# EAGLE design damp_v0001B (EAGLE 6.4)

## Sheet 1 of 2: DAC
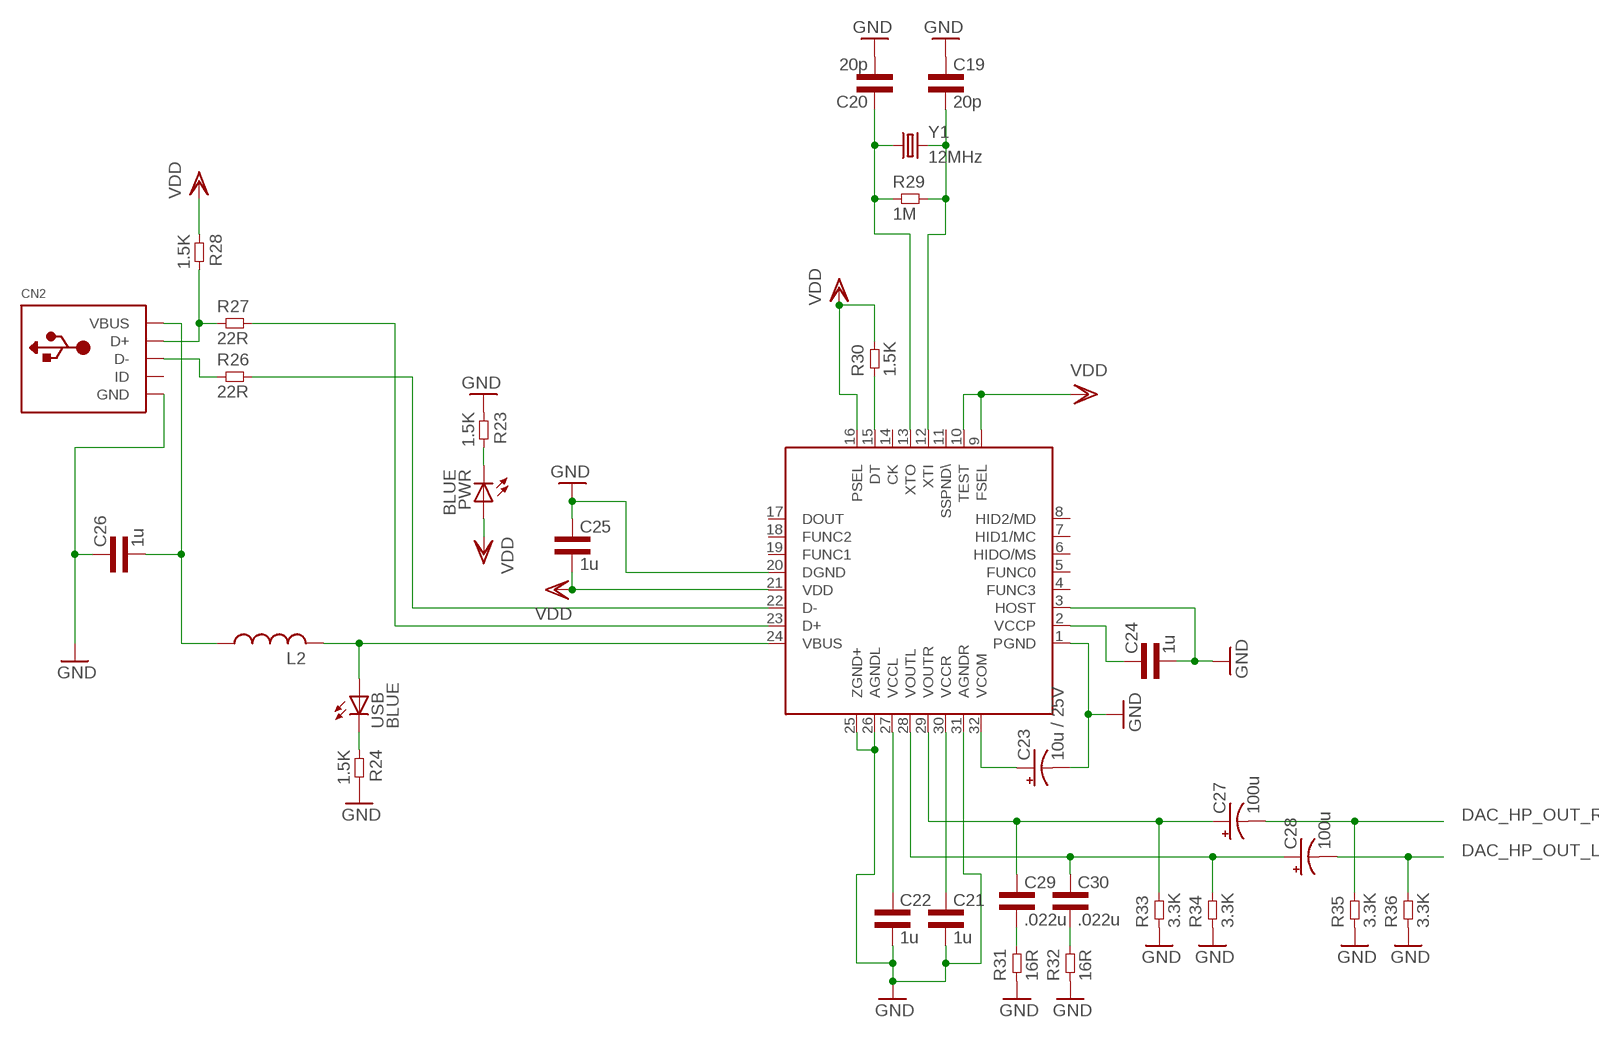
[diagram p0: schematic, sheet 1]

### Parts
C19  20p  CAP0603L3  [0603L3]
C20  20p  CAP0603L3  [0603L3]
C21  1u  CAP0603L3  [0603L3]
C22  1u  CAP0603L3  [0603L3]
C23  10u / 25V  CPOL-USE1.8-4  [E1,8-4]
C24  1u  CAP0603L3  [0603L3]
C25  1u  CAP0603L3  [0603L3]
C26  1u  CAP0603L3  [0603L3]
C27  100u  CPOL-USE2-5  [E2-5]
C28  100u  CPOL-USE2-5  [E2-5]
C29  .022u  CAP0603L3  [0603L3]
C30  .022u  CAP0603L3  [0603L3]
CN2  USBMINIB  [USB-MINIB]
L2  RCL_L-USL3225M  [RCL_L3225M]
PWR  BLUE  LED-BLUE0603  [LED-0603]
R23  1.5K  RES0603L3  [0603L3]
R24  1.5K  RES0603L3  [0603L3]
R26  22R  RES0603L3  [0603L3]
R27  22R  RES0603L3  [0603L3]
R28  1.5K  RES0603L3  [0603L3]
R29  1M  RES0603L3  [0603L3]
R30  1.5K  RES0603L3  [0603L3]
R31  16R  RES0603L3  [0603L3]
R32  16R  RES0603L3  [0603L3]
R33  3.3K  RES0603L3  [0603L3]
R34  3.3K  RES0603L3  [0603L3]
R35  3.3K  RES0603L3  [0603L3]
R36  3.3K  RES0603L3  [0603L3]
U$1  PCM2707_V1_PCM2704C_PCM2707  [PCM2707_V1_PCM2704C_PCM2707]
USB  BLUE  LED-BLUE0603  [LED-0603]
Y1  12MHz  CRYSTALHC49US  [HC49US]

### Nets
DAC_HP_OUT_L: C28.- R36.P$2 ; also sheet 2
DAC_HP_OUT_R: C27.- R35.P$2 ; also sheet 2
GND: C19.P$1 C20.P$2 C21.P$2 C22.P$2 C23.- C24.P$2 C25.P$1 C26.P$1 CN2.GND R23.P$1 R24.P$2 R31.P$1 R32.P$1 R33.P$1 R34.P$1 R35.P$1 R36.P$1 U$1.1(PGND) U$1.3(HOST) U$1.20(DGND) U$1.25(ZGND+) U$1.26(AGNDL) U$1.31(AGNDR) ; also sheet 2
N$2: PWR.C R23.P$2
N$6: R24.P$1 USB.C
N$18: CN2.D+ R27.P$1 R28.P$2
N$21: CN2.D- R26.P$1
N$37: R27.P$2 U$1.23(D+)
N$42: R26.P$2 U$1.22(D-)
N$43: C20.P$1 R29.P$1 U$1.13(XTO) Y1.1
N$44: C19.P$2 R29.P$2 U$1.12(XTI) Y1.2
N$45: C22.P$1 U$1.27(VCCL)
N$50: C21.P$1 U$1.30(VCCR)
N$51: C23.+ U$1.32(VCOM)
N$52: C29.P$2 R31.P$2
N$53: C24.P$1 U$1.2(VCCP)
N$54: C27.+ C29.P$1 R33.P$2 U$1.29(VOUTR)
N$55: L2.2 U$1.24(VBUS) USB.A
N$56: C26.P$2 CN2.VBUS L2.1
N$57: C28.+ C30.P$1 R34.P$2 U$1.28(VOUTL)
N$58: R30.P$1 U$1.15(DT)
N$59: C30.P$2 R32.P$2
VDD: C25.P$2 PWR.A R28.P$1 R30.P$2 U$1.9(FSEL) U$1.10(TEST) U$1.16(PSEL) U$1.21(VDD)
Unconnected: CN2.ID U$1.4(FUNC3) U$1.5(FUNC0) U$1.6(HIDO/MS) U$1.7(HID1/MC) U$1.8(HID2/MD) U$1.11(SSPND\) U$1.14(CK) U$1.17(DOUT) U$1.18(FUNC2) U$1.19(FUNC1)

## Sheet 2 of 2: Amp
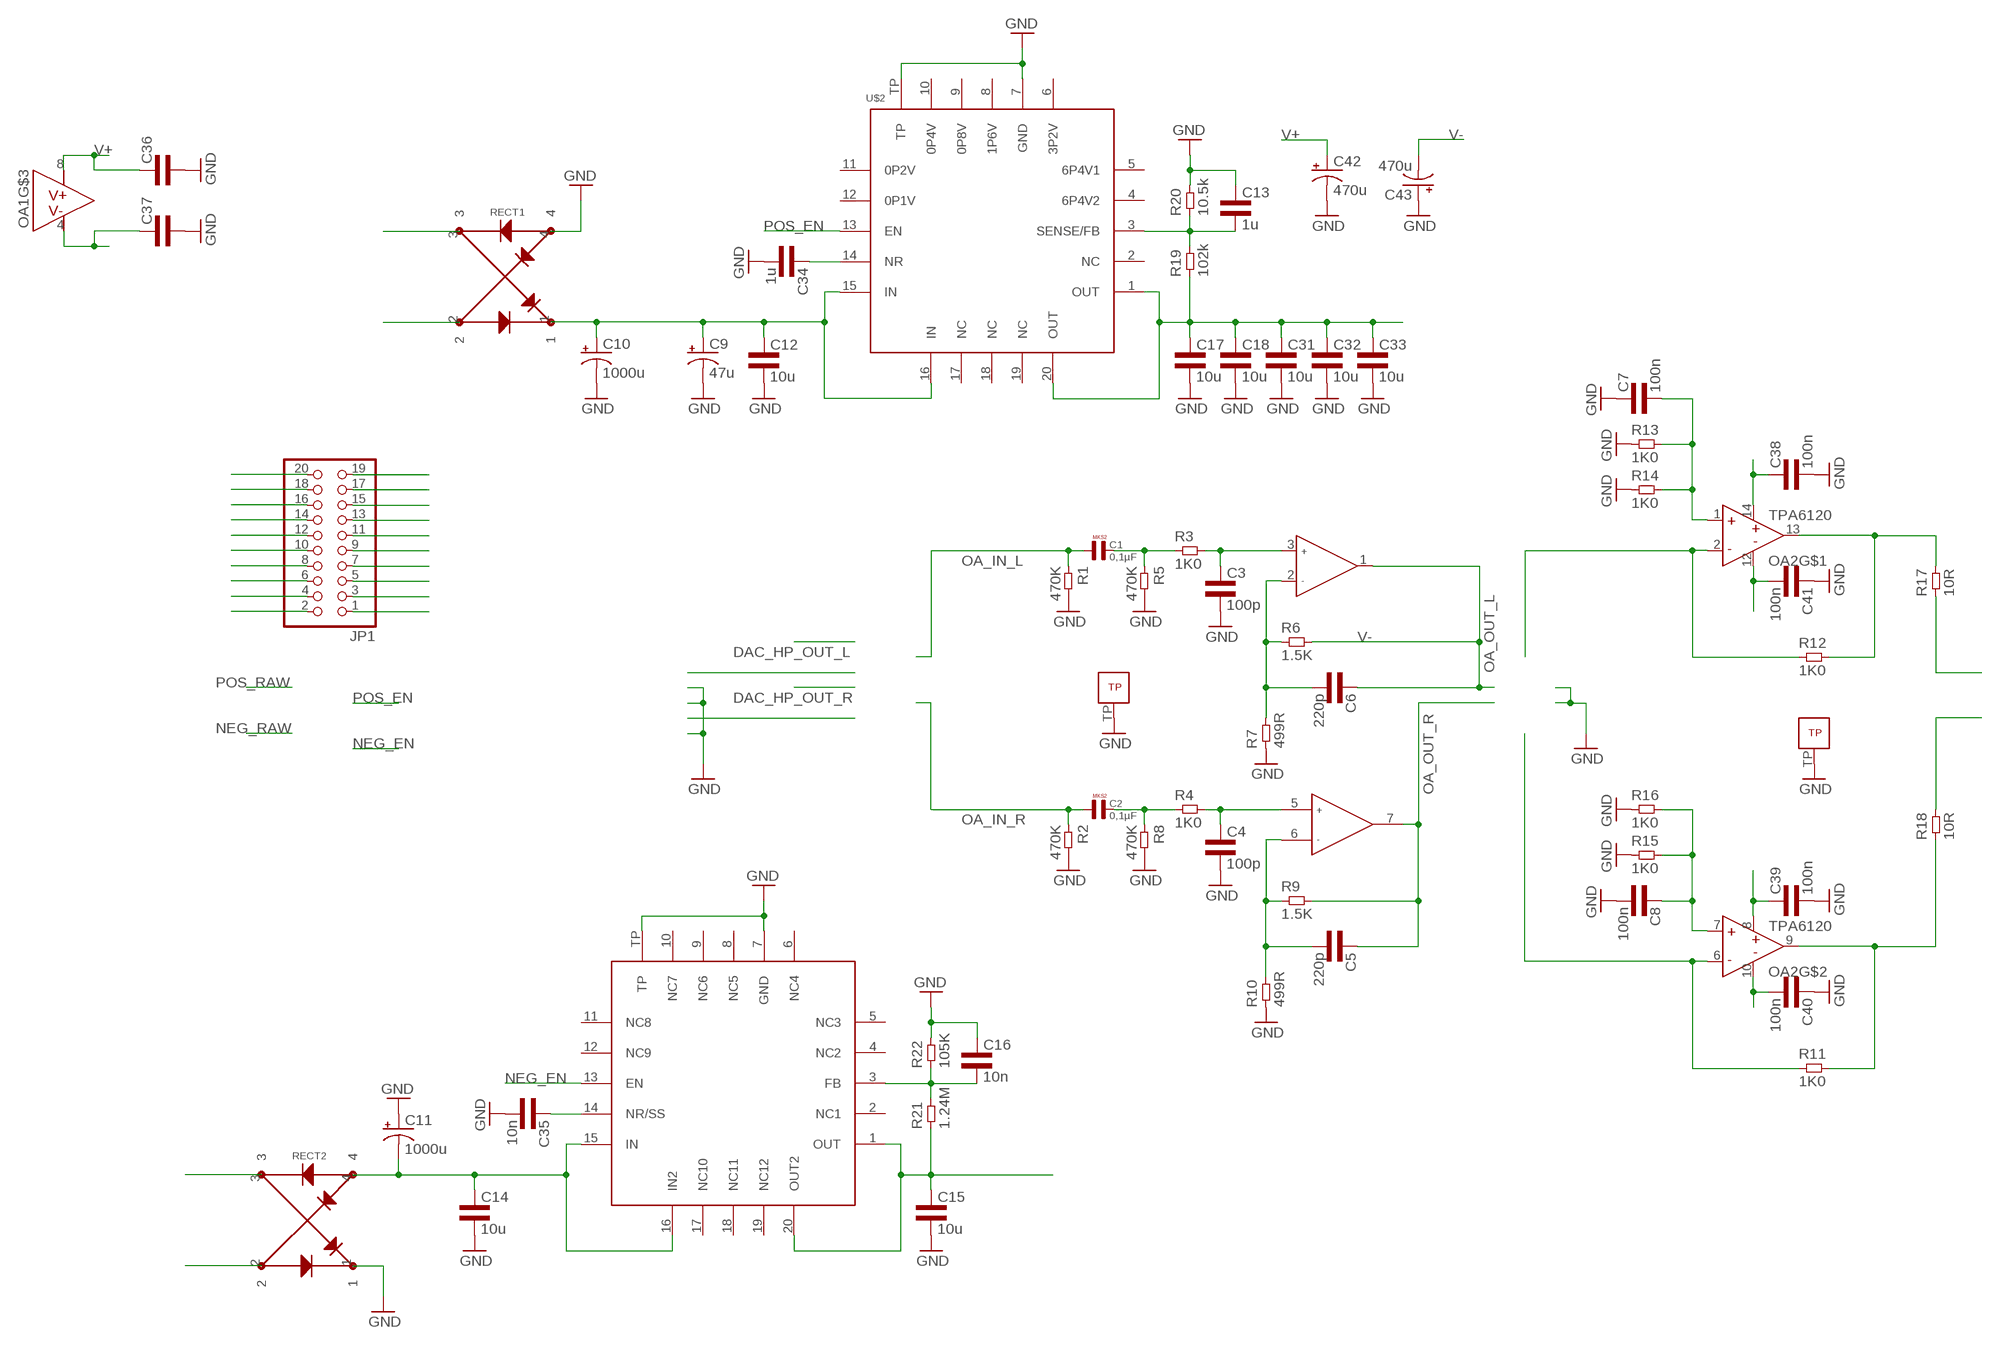
[diagram p1: schematic, sheet 2]

### Parts
C1  0,1µF  [R5B2K5]
C2  0,1µF  [R5B2K5]
C3  100p  CAP0603L3  [0603L3]
C4  100p  CAP0603L3  [0603L3]
C5  220p  CAP0603L3  [0603L3]
C6  220p  CAP0603L3  [0603L3]
C7  100n  CAP0603L3  [0603L3]
C8  100n  CAP0603L3  [0603L3]
C9  47u  CPOL-USCT7343  [CT7343]
C10  1000u  CPOL-USE7.5-16  [E7,5-16]
C11  1000u  CPOL-USE7.5-16  [E7,5-16]
C12  10u  CAP0805L3  [0805L3]
C13  1u  CAP0603L3  [0603L3]
C14  10u  CAP0805L3  [0805L3]
C15  10u  CAP0805L3  [0805L3]
C16  10n  CAP0603L3  [0603L3]
C17  10u  CAP0805L3  [0805L3]
C18  10u  CAP0805L3  [0805L3]
C31  10u  CAP0805L3  [0805L3]
C32  10u  CAP0805L3  [0805L3]
C33  10u  CAP0805L3  [0805L3]
C34  1u  CAP0603L3  [0603L3]
C35  10n  CAP0603L3  [0603L3]
C36  CAP0603L3  [0603L3]
C37  CAP0603L3  [0603L3]
C38  100n  CAP0603L3  [0603L3]
C39  100n  CAP0603L3  [0603L3]
C40  100n  CAP0603L3  [0603L3]
C41  100n  CAP0603L3  [0603L3]
C42  470u  CPOL-USE5-10.5  [E5-10,5]
C43  470u  CPOL-USE5-10.5  [E5-10,5]
JP1  PINHD-2X10  [2X10]
OA1  OPA1612  [S-PWSON-N8]
OA2  TPA6120QFN  [S-PVQFN-N14]
R1  470K  RES0603L3  [0603L3]
R2  470K  RES0603L3  [0603L3]
R3  1K0  RES0603L3  [0603L3]
R4  1K0  RES0603L3  [0603L3]
R5  470K  RES0603L3  [0603L3]
R6  1.5K  RES0603L3  [0603L3]
R7  499R  RES0603L3  [0603L3]
R8  470K  RES0603L3  [0603L3]
R9  1.5K  RES0603L3  [0603L3]
R10  499R  RES0603L3  [0603L3]
R11  1K0  RES0603L3  [0603L3]
R12  1K0  RES0603L3  [0603L3]
R13  1K0  RES0603L3  [0603L3]
R14  1K0  RES0603L3  [0603L3]
R15  1K0  RES0603L3  [0603L3]
R16  1K0  RES0603L3  [0603L3]
R17  10R  RES1206L3  [1206L3]
R18  10R  RES1206L3  [1206L3]
R19  102k  RES0603L3  [0603L3]
R20  10.5k  RES0603L3  [0603L3]
R21  1.24M  RES0603L3  [0603L3]
R22  105K  RES0603L3  [0603L3]
RECT1  RECTIFIER_Z4GP206  [RECTIFIER_ABS-4]
RECT2  RECTIFIER_Z4GP206  [RECTIFIER_ABS-4]
U$2  POWER-SUPPLY_POS_V1_TI_LDO_TPS7A4700  [POWER-SUPPLY_POS_V1_TI_LDO_VQFN-20]
U$3  POWER-SUPPLY_POS_V1_TI_LDO_TPS7A3301RGWT  [POWER-SUPPLY_POS_V1_TI_LDO_VQFN-20]

### Nets
AC1: RECT1.3
AC2: RECT1.2
AC3: RECT2.3
AC4: RECT2.2
GND: C3.P$2 C4.P$2 C7.P$1 C8.P$2 C9.- C10.- C11.+ C12.2 C13.P$1 C14.2 C15.2 C16.P$1 C17.2 C18.2 C31.2 C32.2 C33.2 C34.P$2 C35.P$2 C36.P$2 C37.P$2 C38.P$2 C39.P$2 C40.P$1 C41.P$1 C42.- C43.+ OA1.TP OA2.TP R1.P$2 R2.P$2 R5.P$2 R7.P$1 R8.P$2 R10.P$1 R13.P$1 R14.P$1 R15.P$1 R16.P$1 R20.P$2 R22.P$2 RECT1.4 RECT2.1 U$2.7(GND) U$2.TP U$3.7(GND) U$3.TP ; also sheet 1
N$4: C34.P$1 U$2.14(NR)
N$5: OA2.9(OUT) R11.P$2 R18.1
N$7: C1.2 R3.P$1 R5.P$1
N$8: C3.P$1 OA1.3(INA+) R3.P$2
N$9: C6.P$2 OA1.2(INA-) R6.P$1 R7.P$2
N$10: OA2.2(IN-) R12.P$1
N$11: JP1.19
N$12: C2.2 R4.P$1 R8.P$1
N$13: C4.P$1 OA1.5(INB+) R4.P$2
N$14: JP1.17
N$15: C5.P$2 OA1.6(INB-) R9.P$1 R10.P$2
N$16: JP1.15
N$17: C7.P$2 OA2.1(IN+) R13.P$2 R14.P$2
N$19: C8.P$1 OA2.7(IN+) R15.P$2 R16.P$2
N$20: R17.1
N$22: R18.2
N$23: C13.P$2 R19.P$2 R20.P$1 U$2.3(SENSE/FB)
N$24: C16.P$2 R21.P$2 R22.P$1 U$3.3(FB)
N$25: C35.P$1 U$3.14(NR/SS)
N$26: OA2.6(IN-) R11.P$1
N$27: OA2.13(OUT) R12.P$2 R17.2
N$28: JP1.13
N$29: JP1.11
N$30: JP1.9
N$31: JP1.7
N$32: JP1.5
N$33: JP1.3
N$34: JP1.1
N$38: JP1.16
N$39: JP1.14
N$40: JP1.12
N$41: JP1.10
N$46: JP1.8
N$47: JP1.6
N$48: JP1.4
N$49: JP1.2
NEG_EN: U$3.13(EN)
NEG_RAW: C11.- C14.1 JP1.18 RECT2.4 U$3.15(IN) U$3.16(IN2)
OA_IN_L: C1.1 R1.P$1
OA_IN_R: C2.1 R2.P$1
OA_OUT_L: C6.P$1 OA1.1(OUTA) R6.P$2
OA_OUT_R: C5.P$1 OA1.7(OUTB) R9.P$2
POS_EN: U$2.13(EN)
POS_RAW: C9.+ C10.+ C12.1 JP1.20 RECT1.1 U$2.15(IN) U$2.16(IN)
V+: C17.1 C18.1 C31.1 C32.1 C33.1 C36.P$1 C39.P$1 C41.P$2 C42.+ OA2.8(V+) OA2.12(V-) R19.P$1 U$2.1(OUT) U$2.20(OUT)
V-: C15.1 C37.P$1 C38.P$1 C40.P$2 C43.- OA2.10(V-) OA2.14(V+) R21.P$1 U$3.1(OUT) U$3.20(OUT2)
Unconnected: U$2.2(NC) U$2.4(6P4V2) U$2.5(6P4V1) U$2.6(3P2V) U$2.8(1P6V) U$2.9(0P8V) U$2.10(0P4V) U$2.11(0P2V) U$2.12(0P1V) U$2.17(NC) U$2.18(NC) U$2.19(NC) U$3.2(NC1) U$3.4(NC2) U$3.5(NC3) U$3.6(NC4) U$3.8(NC5) U$3.9(NC6) U$3.10(NC7) U$3.11(NC8) U$3.12(NC9) U$3.17(NC10) U$3.18(NC11) U$3.19(NC12)

## Power pins joined to a net without a drawn wire
V+: OA1.8(V+)
V-: OA1.4(V-)

## Library data of the parts
C1 C2 = Capacitor-Wima-MKS2-63v:0,1µF
C3-C8 C12-C22 C24-C26 C29-C41 = common:CAP
C9-C11 C23 C27 C28 C42 C43 = rcl:CPOL-US: POLARIZED CAPACITOR, American symbol
CN2 = adafruit:USB: USB Connectors USBMINIB - Surface Mount Female Mini-B USB Connector 4UConnector: 06564 By microbuilder.eu Thru-hole RA Female Mini-B USB Connector 4UConnector: 18732 By ladyada.net
JP1 = pinhead:PINHD-2X10: PIN HEADER
L2 = pcm2707_v1:RCL_L-US: INDUCTOR, American symbol
OA1 = common:OPA1612
OA2 = common:TPA6120
PWR USB = SparkFun-LED:LED-BLUE: Blue LEDs for production use Various blue LEDs stocked by SparkFun production 0603 - DIO-08575 Rebel - DIO-09553 1206 - DIO-09911; PROD_ID: DIO-08575
R1-R24 R26-R36 = common:RES
RECT1 RECT2 = my_dac_amp:RECTIFIER_Z4GP206
U$1 = my_dac_amp:PCM2707_V1_PCM2704C_PCM2707: Upgraded version of the PCM2704. It allows connecting to a device with USB and transmitting that data to another DAC using I2S protocol. Also has other advanced features that allow control with SPI, external buttons, etc.
U$2 = my_dac_amp:POWER-SUPPLY_POS_V1_TI_LDO_TPS7A4700
U$3 = my_dac_amp:POWER-SUPPLY_POS_V1_TI_LDO_TPS7A3301RGWT: Ultra-Low Noise NEGATIVE Voltage Reglator
Y1 = SparkFun-FreqCtrl:CRYSTAL: Various standard crystals. Proven footprints. Spark Fun Electronics SKU : COM-00534

## Board
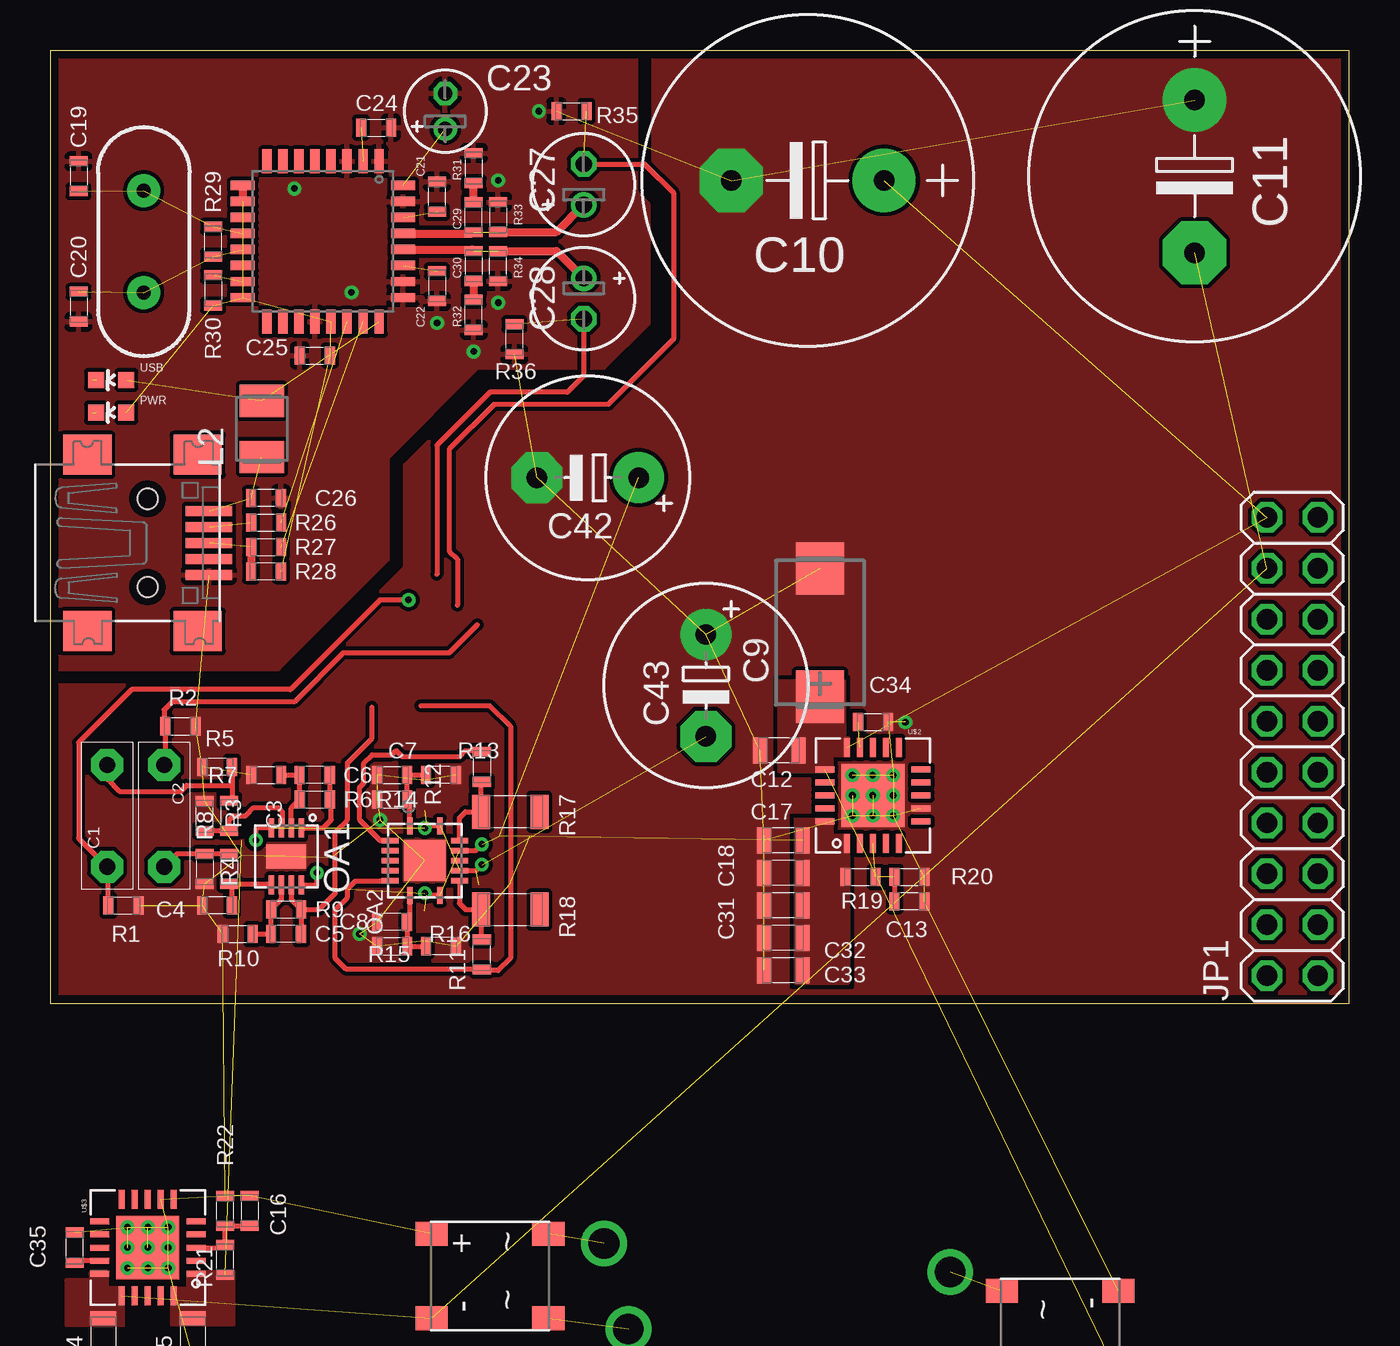
[diagram p2: board, top side]
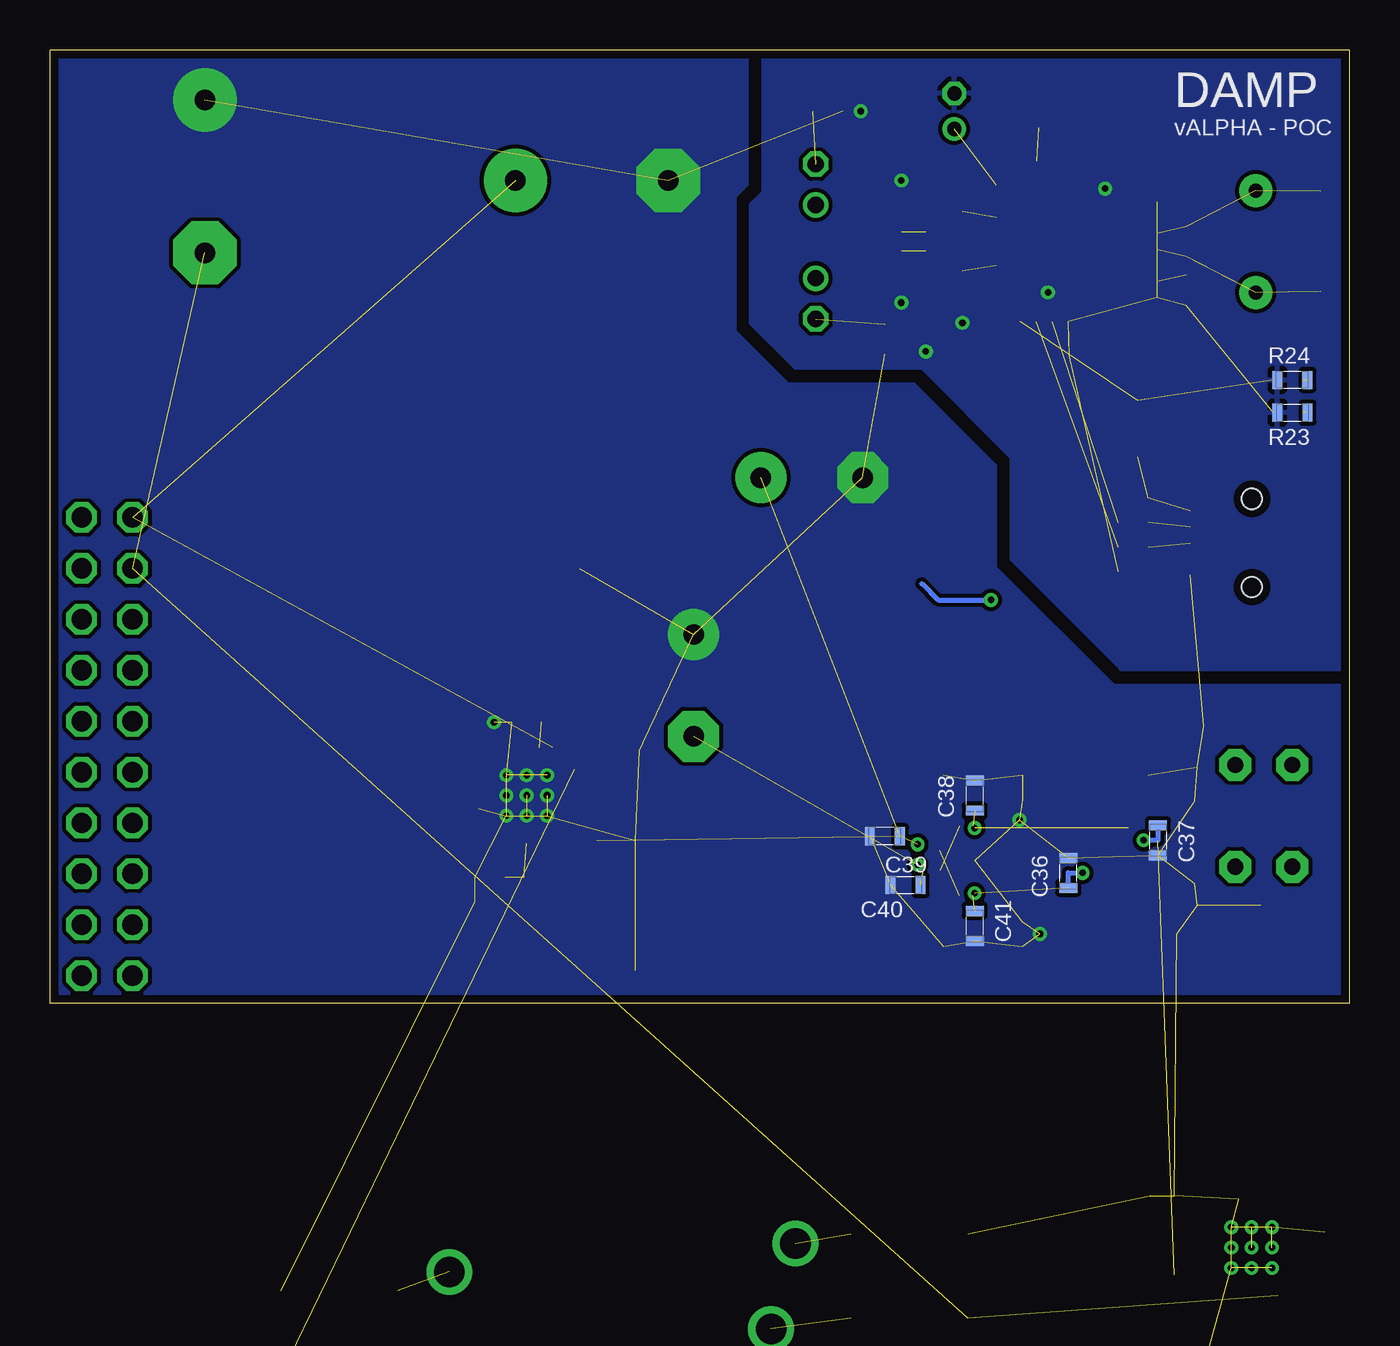
[diagram p3: board, bottom side, seen from below]

Size 64.82 x 47.55 mm. Coordinates in mm from the lower left corner, seen from the top.
Outline: 0,0 64.82,0 64.82,47.55 0,47.55 0,0
Copper layers (1*16): Top 0.035mm / dielectric 1.5mm / Bottom 0.035mm
Design rules "default *": minimum track width 8mil, minimum drill 13mil, track to track 8mil, track to pad 8mil, pad to pad 8mil, via to via 8mil, smd to smd 8mil, copper to edge 16mil, drill to drill 8mil, minimum pad ring 7mil, minimum via ring 7mil, stop-mask expansion 4mil, vias tented up to drill 18mil, thermal gap 10mil

### Footprints (pad centres in the part's own frame; a part is rotated, then mirrored left to right if it is on the bottom)
R5B2K5 = drill 0.813 pad 1.6 octagon: 1 -2.54,0; 2 2.54,0
0603L3 = smd 0.5 x 0.9: P$1 -0.75,0; P$2 0.75,0
CT7343 = smd 2.6 x 2.4: + -3.2,0; - 3.2,0
E7,5-16 = drill 1.016 pad 3.15: + -3.81,0 | drill 1.016 pad 3.15 octagon: - 3.81,0
0805L3 = smd 0.7 x 1.3: 1 -0.95,0; 2 0.95,0
E1,8-4 = drill 0.711 pad 1.168: + -0.889,0 | drill 0.711 pad 1.168 octagon: - 0.889,0
E2-5 = drill 0.813 pad 1.27: + -1.016,0 | drill 0.813 pad 1.27 octagon: - 1.016,0
E5-10,5 = drill 1.016 pad 2.54: + -2.54,0 | drill 1.016 pad 2.54 octagon: - 2.54,0
USB-MINIB = smd 0.5 x 2.308: D+ 0,4.064; D- -0.8,4.064; GND 1.6,4.064; ID 0.8,4.064; VBUS -1.6,4.064 | smd 2 x 2.4: GND1 -4.4,-2; GND2 -4.4,3.5; GND3 4.4,3.5; GND4 4.4,-2 | hole 1: -2.2,1; 2.2,1
2X10 = drill 1.016 octagon: 1 -11.43,-1.27; 2 -11.43,1.27; 3 -8.89,-1.27; 4 -8.89,1.27; 5 -6.35,-1.27; 6 -6.35,1.27; 7 -3.81,-1.27; 8 -3.81,1.27; 9 -1.27,-1.27; 10 -1.27,1.27; 11 1.27,-1.27; 12 1.27,1.27; 13 3.81,-1.27; 14 3.81,1.27; 15 6.35,-1.27; 16 6.35,1.27; 17 8.89,-1.27; 18 8.89,1.27; 19 11.43,-1.27; 20 11.43,1.27
RCL_L3225M = smd 1.6 x 2.2: 1 -1.4,0; 2 1.4,0
S-PWSON-N8 = smd 0.28 x 0.95: 1 -0.75,-1.425; 2 -0.25,-1.425; 3 0.25,-1.425; 4 0.75,-1.425; 5 0.75,1.425; 6 0.25,1.425; 7 -0.25,1.425; 8 -0.75,1.425 | smd 2 x 1.2: TP 0,0
S-PVQFN-N14 = smd 0.85 x 0.28: 1 -1.725,-0.75; 7 1.725,-0.75; 8 1.725,0.75; 14 -1.725,0.75 | smd 0.28 x 0.85: 2 -1,-1.725; 3 -0.5,-1.725; 4 0,-1.725; 5 0.5,-1.725; 6 1,-1.725; 9 1,1.725; 10 0.5,1.725; 11 0,1.725; 12 -0.5,1.725; 13 -1,1.725 | smd 2.05 x 2.05: TP 0,0
LED-0603 = smd 0.8 x 0.8: A 0,-0.75; C 0,0.75
1206L3 = smd 0.9 x 1.7: 1 -1.45,0; 2 1.45,0
RECTIFIER_ABS-4 = smd 1.2 x 1.6: 1 2.1,2.91; 2 2.1,-2.91; 3 -2.1,-2.91; 4 -2.1,2.91
PCM2707_V1_PCM2704C_PCM2707 = smd 0.47 x 1.2: 1 -2.8,-4; 2 -2,-4; 3 -1.2,-4; 4 -0.4,-4; 5 0.4,-4; 6 1.2,-4; 7 2,-4; 8 2.8,-4; 17 2.8,4; 18 2,4; 19 1.2,4; 20 0.4,4; 21 -0.4,4; 22 -1.2,4; 23 -2,4; 24 -2.8,4 | smd 1.2 x 0.47: 9 4,-2.8; 10 4,-2; 11 4,-1.2; 12 4,-0.4; 13 4,0.4; 14 4,1.2; 15 4,2; 16 4,2.8; 25 -4,2.8; 26 -4,2; 27 -4,1.2; 28 -4,0.4; 29 -4,-0.4; 30 -4,-1.2; 31 -4,-2; 32 -4,-2.8
POWER-SUPPLY_POS_V1_TI_LDO_VQFN-20 = smd 0.3 x 0.95: 1 -1.3,-2.4; 2 -0.65,-2.4; 3 0,-2.4; 4 0.65,-2.4; 5 1.3,-2.4; 11 1.3,2.4; 12 0.65,2.4; 13 0,2.4; 14 -0.65,2.4; 15 -1.3,2.4 | smd 0.95 x 0.3: 6 2.4,-1.3; 7 2.4,-0.65; 8 2.4,0; 9 2.4,0.65; 10 2.4,1.3; 16 -2.4,1.3; 17 -2.4,0.65; 18 -2.4,0; 19 -2.4,-0.65; 20 -2.4,-1.3 | smd 3.15 x 3.15: TP 0,0
HC49US = drill 0.7 pad 1.651: 1 -2.54,0; 2 2.54,0

### Placement (x,y rotation side)
C1  2.84,9.35 90 top
C2  5.69,9.35 270 top
C3  7.72,9.35 90 top
C4  8.33,4.88 180 top
C5  11.79,3.45 180 top
C6  13.21,11.38 180 top
C7  17.07,11.38 0 top
C8  17.07,4.06 180 top
C9  38.4,18.49 90 top
C10  37.8,41.05 180 top
C11  57.1,41.25 270 top
C12  36.37,12.6 180 top
C13  42.88,5.08 180 top
C14  2.64,-16.66 270 top  (outside the outline)
C15  7.11,-16.66 270 top  (outside the outline)
C16  9.96,-10.36 270 top  (outside the outline)
C17  36.58,8.13 180 top
C18  36.58,6.5 180 top
C19  1.42,41.25 270 top
C20  1.42,34.75 270 top
C21  19.3,40.23 90 top
C22  19.3,35.76 270 top
C23  19.71,44.5 90 top
C24  16.26,43.69 0 top
C25  13.21,32.31 0 top
C26  10.77,25.2 180 top
C27  26.62,40.84 90 top
C28  26.62,35.15 270 top
C29  21.13,39.22 90 top
C30  21.13,36.78 270 top
C31  36.58,4.88 180 top
C32  36.58,3.25 180 top
C33  36.58,1.63 180 top
C34  41.05,14.02 0 top
C35  1.22,-12.19 90 top  (outside the outline)
C36  14.02,6.5 90 bottom
C37  9.55,8.13 270 bottom
C38  18.69,10.36 90 bottom
C39  23.16,8.33 180 bottom
C40  22.15,5.89 0 bottom
C41  18.69,3.86 90 bottom
C42  26.82,26.21 180 top
C43  32.72,15.85 270 top
CN2  3.86,22.96 270 top
JP1  61.98,12.8 90 top
L2  10.57,28.65 90 top
OA1  11.79,7.32 180 top
OA2  18.69,7.11 270 top
PWR  3.05,29.46 90 top
R1  3.66,4.88 0 top
R2  6.5,13.82 0 top
R3  8.94,9.35 270 top
R4  8.94,6.71 270 top
R5  8.33,11.79 180 top
R6  13.21,10.16 0 top
R7  10.77,11.38 0 top
R8  7.72,6.71 270 top
R9  11.79,4.67 0 top
R10  9.35,3.45 0 top
R11  21.54,2.44 90 top
R12  21.54,11.79 270 top
R13  19.51,11.38 180 top
R14  17.07,10.16 0 top
R15  17.07,2.84 0 top
R16  19.51,2.84 180 top
R17  22.96,9.55 180 top
R18  22.96,4.67 0 top
R19  40.44,6.3 0 top
R20  42.88,6.3 0 top
R21  8.74,-12.8 90 top  (outside the outline)
R22  8.74,-10.36 90 top  (outside the outline)
R23  2.84,29.46 0 bottom
R24  2.84,31.09 180 bottom
R26  10.77,23.98 0 top
R27  10.77,22.76 0 top
R28  10.77,21.54 180 top
R29  8.13,38 90 top
R30  8.13,35.56 270 top
R31  21.13,41.66 270 top
R32  21.13,34.34 90 top
R33  22.35,39.22 270 top
R34  22.35,36.78 90 top
R35  26.01,44.5 0 top
R36  23.16,33.12 90 top
RECT1  50.39,-16.46 270 top  (outside the outline)
RECT2  21.95,-13.61 90 top  (outside the outline)
U$1  13.61,38 180 top
U$2  41.05,10.36 0 top
U$3  4.88,-12.19 90 top  (outside the outline)
USB  3.05,31.09 90 top
Y1  4.67,38 90 top

### Tracks (layer width: path | path; a pad name or v marks a point on that pad's centre or on a via)
AC1  (via drill 1.52)  (1 unrouted)
  other vias: 44.91,-13.41
AC2  (via drill 1.52)  (1 unrouted)
  other vias: 44.91,-19.3
AC3  (via drill 1.52)  (1 unrouted)
  other vias: 28.85,-16.26
AC4  (via drill 1.52)  (1 unrouted)
  other vias: 27.64,-11.99
DAC_HP_OUT_L  (1 unrouted)
  Top 0.254: C28.- 26.62,31.29 25.81,30.48 21.95,30.48 19.3,27.84 19.3,21.39
DAC_HP_OUT_R  (1 unrouted)
  Top 0.254: C27.- 29.67,41.86 31.09,40.44 31.09,33.12 27.84,29.87 22.15,29.87 19.91,27.64 19.91,22.56 20.32,22.15 20.32,19.86
GND  (via drill 0.33)  (66 unrouted)
  other vias: 42.67,14.02 22.35,41.05 22.35,34.95 21.13,32.51 19.3,33.93 24.38,44.5 12.19,40.64 42.06,11.38 42.06,9.35 42.06,10.36 41.05,11.38 41.05,10.36 41.05,9.35 40.03,11.38 40.03,10.36 40.03,9.35 3.86,-11.18 4.88,-11.18 5.89,-11.18 4.88,-12.19 4.88,-13.21 3.86,-12.19 5.89,-12.19 5.89,-13.21 3.86,-13.21 15.04,35.46 16.46,9.14 15.44,3.45
  pour Top (rank 6): 0.41,16.66 11.38,16.66 16.87,22.15 16.87,27.23 21.34,31.7 27.64,31.7 29.87,33.93 29.87,39.83 29.26,40.44 29.26,47.14 0.41,47.14
  pour Bottom: 29.26,47.14 29.26,40.44 29.87,39.83 29.87,33.93 27.64,31.7 21.34,31.7 16.87,27.23 16.87,22.15 11.38,16.66 0.41,16.66 0.41,47.14
  pour Bottom (no thermals): 30.07,47.14 30.07,40.84 30.68,40.23 30.68,33.53 28.04,30.89 21.74,30.89 17.68,26.82 17.68,21.74 11.79,15.85 0.41,15.85 0.41,0.41 64.41,0.41 64.41,47.14
  pour Top (rank 6, no thermals): 30.07,47.14 30.07,40.84 30.68,40.23 30.68,33.53 28.04,30.89 21.74,30.89 17.68,26.82 17.68,21.74 11.79,15.85 0.41,15.85 0.41,0.41 64.41,0.41 64.41,47.14
N$2  (1 unrouted)
N$4  (1 unrouted)
N$5
  Top 0.254: R11.P$2 21.51,3.22 R18.1 20.73,4.67 20.42,4.98 OA2.9
N$6  (1 unrouted)
N$7
  Top 0.254: R5.P$1 9.08,10.87 | 9.08,10.87 9.08,10.24 R3.P$1 | C1.2 2.85,11.18 3.45,10.57 6.5,10.57 6.81,10.87 9.08,10.87
N$8
  Top 0.254: OA1.3 11.58,8.79 11.58,9.55 11.38,9.75 10.16,9.75 9.75,9.35 9.14,9.35 8.94,9.14 R3.P$2 C3.P$1
N$9
  Top 0.254: OA1.2 12.04,9.74 R6.P$1 C6.P$2 R7.P$2
N$10
  Top 0.254: R12.P$1 21.48,12.6 20.73,12.6 20.42,12.29 17.58,12.29 17.27,12.6 17.07,12.4 16.05,12.4 15.65,11.99 15.65,10.97 15.44,10.77 15.44,9.14 16.48,8.11 OA2.2
N$12
  Top 0.254: C2.2 6.34,7.46 R8.P$1 R4.P$1
N$13
  Top 0.254: OA1.5 10.97,5.96 R4.P$2 9.08,5.82 C4.P$1
N$15
  Top 0.254: OA1.6 11.54,5.17 R9.P$1 C5.P$2 R10.P$2
N$17
  Top 0.254: OA2.1 17.94,10.03 R14.P$2 C7.P$2 R13.P$2
N$18  (1 unrouted)
  Top 0.406: R27.P$1 R28.P$2
N$19
  Top 0.254: OA2.7 17.94,4.19 C8.P$1 R15.P$2 R16.P$2
N$21  (1 unrouted)
N$23  (2 unrouted)
  Top 0.254: R20.P$1 C13.P$2
N$24
  Top 0.254: U$3.3 8.6,-12.19 R21.P$2 R22.P$1 C16.P$2
N$25
  Top 0.254: U$3.14 1.32,-12.84 C35.P$1
N$26
  Top 0.254: OA2.6 16.95,6.1 15.24,6.1 14.83,5.69 14.83,5.28 14.22,4.67 14.22,2.24 14.77,1.69 R11.P$1 21.6,1.63 22.35,1.63 22.96,2.24 22.96,13.82 21.95,14.83 18.49,14.83
N$27
  Top 0.254: R12.P$2 21.51,11.01 R17.2 20.73,9.55 20.42,9.24 OA2.13
N$37  (1 unrouted)
N$42  (1 unrouted)
N$43  (3 unrouted)
N$44  (3 unrouted)
N$45  (1 unrouted)
N$50  (1 unrouted)
N$51  (1 unrouted)
N$52
  Top 0.406: C29.P$2 R31.P$2
N$53  (1 unrouted)
N$54  (1 unrouted)
  Top 0.406: U$1.29 21.06,38.4 C29.P$1 | R33.P$2 25.26,38.47 C27.+
N$55  (2 unrouted)
N$56  (2 unrouted)
N$57  (1 unrouted)
  Top 0.406: U$1.28 21.06,37.6 C30.P$1 | R34.P$2 25.26,37.53 C28.+
N$58  (1 unrouted)
N$59
  Top 0.406: C30.P$2 R32.P$2
NEG_RAW  (3 unrouted)
  pour Top (no thermals): 2.84,-13.41 2.03,-13.41 2.03,-13.82 0.81,-13.82 0.81,-16.05 3.66,-16.05 3.66,-14.22 2.84,-14.22
OA_IN_L  (via drill 0.33)
  Top 0.254: R1.P$1 2.91,6.74 C1.1 1.42,8.23 1.42,13 4.06,15.65 11.99,15.65 16.46,20.12 v17.88,20.12
  Bottom 0.254: 21.34,20.93 20.52,20.12 v17.88,20.12
OA_IN_R
  Top 0.254: C2.1 5.75,11.95 R2.P$1 5.69,13.88 5.69,14.63 6.1,15.04 12.19,15.04 14.63,17.48 19.91,17.48 21.31,18.87
OA_OUT_L
  Top 0.254: C6.P$1 R6.P$2 14.02,10.1 14.02,9.14 13.62,8.74 OA1.1
OA_OUT_R
  Top 0.254: OA1.7 12.04,5.17 R9.P$2 | R9.P$2 C5.P$1 | R9.P$2 13.41,4.67 14.22,5.49 14.22,8.53 14.83,9.14 14.83,11.99 16.05,13.21 16.05,14.77
POS_RAW  (3 unrouted)
  pour Top (no thermals): 39.83,13.21 39.62,13.21 39.62,16.05 36.37,16.05 36.37,11.58 39.01,11.58 39.01,12.4 39.83,12.4
V+  (via drill 0.33)  (6 unrouted)
  Top 0.254: OA1.8 13.31,5.89 v13.31,6.5 | OA2.8 18.79,5.39 v18.69,5.49 | OA2.12 21.23,7.61 v21.54,7.92
  Bottom 0.254: C36.P$1 14.02,6.5 v13.31,6.5
  pour Top (no thermals): 39.83,8.33 39.01,8.33 39.01,9.14 37.19,9.14 37.19,1.02 39.83,1.02
V-  (via drill 0.33)  (6 unrouted)
  Top 0.254: OA1.4 10.26,8.74 v10.26,8.13 | OA2.14 18.79,8.84 v18.69,8.74 | OA2.10 21.24,6.61 v21.54,6.91
  Bottom 0.254: C37.P$1 9.55,8.13 v10.26,8.13
  pour Top (no thermals): 6.91,-13.41 9.14,-13.41 9.14,-16.05 6.1,-16.05 6.1,-14.22 6.91,-14.22
VDD  (6 unrouted)
  Top 0.406: U$1.9 U$1.10

### Text on the board
bPlace: DAMP | vALPHA - POC | Designed By: | Travis E